# EAGLE design auxDaqUnit (EAGLE 9.6.1)
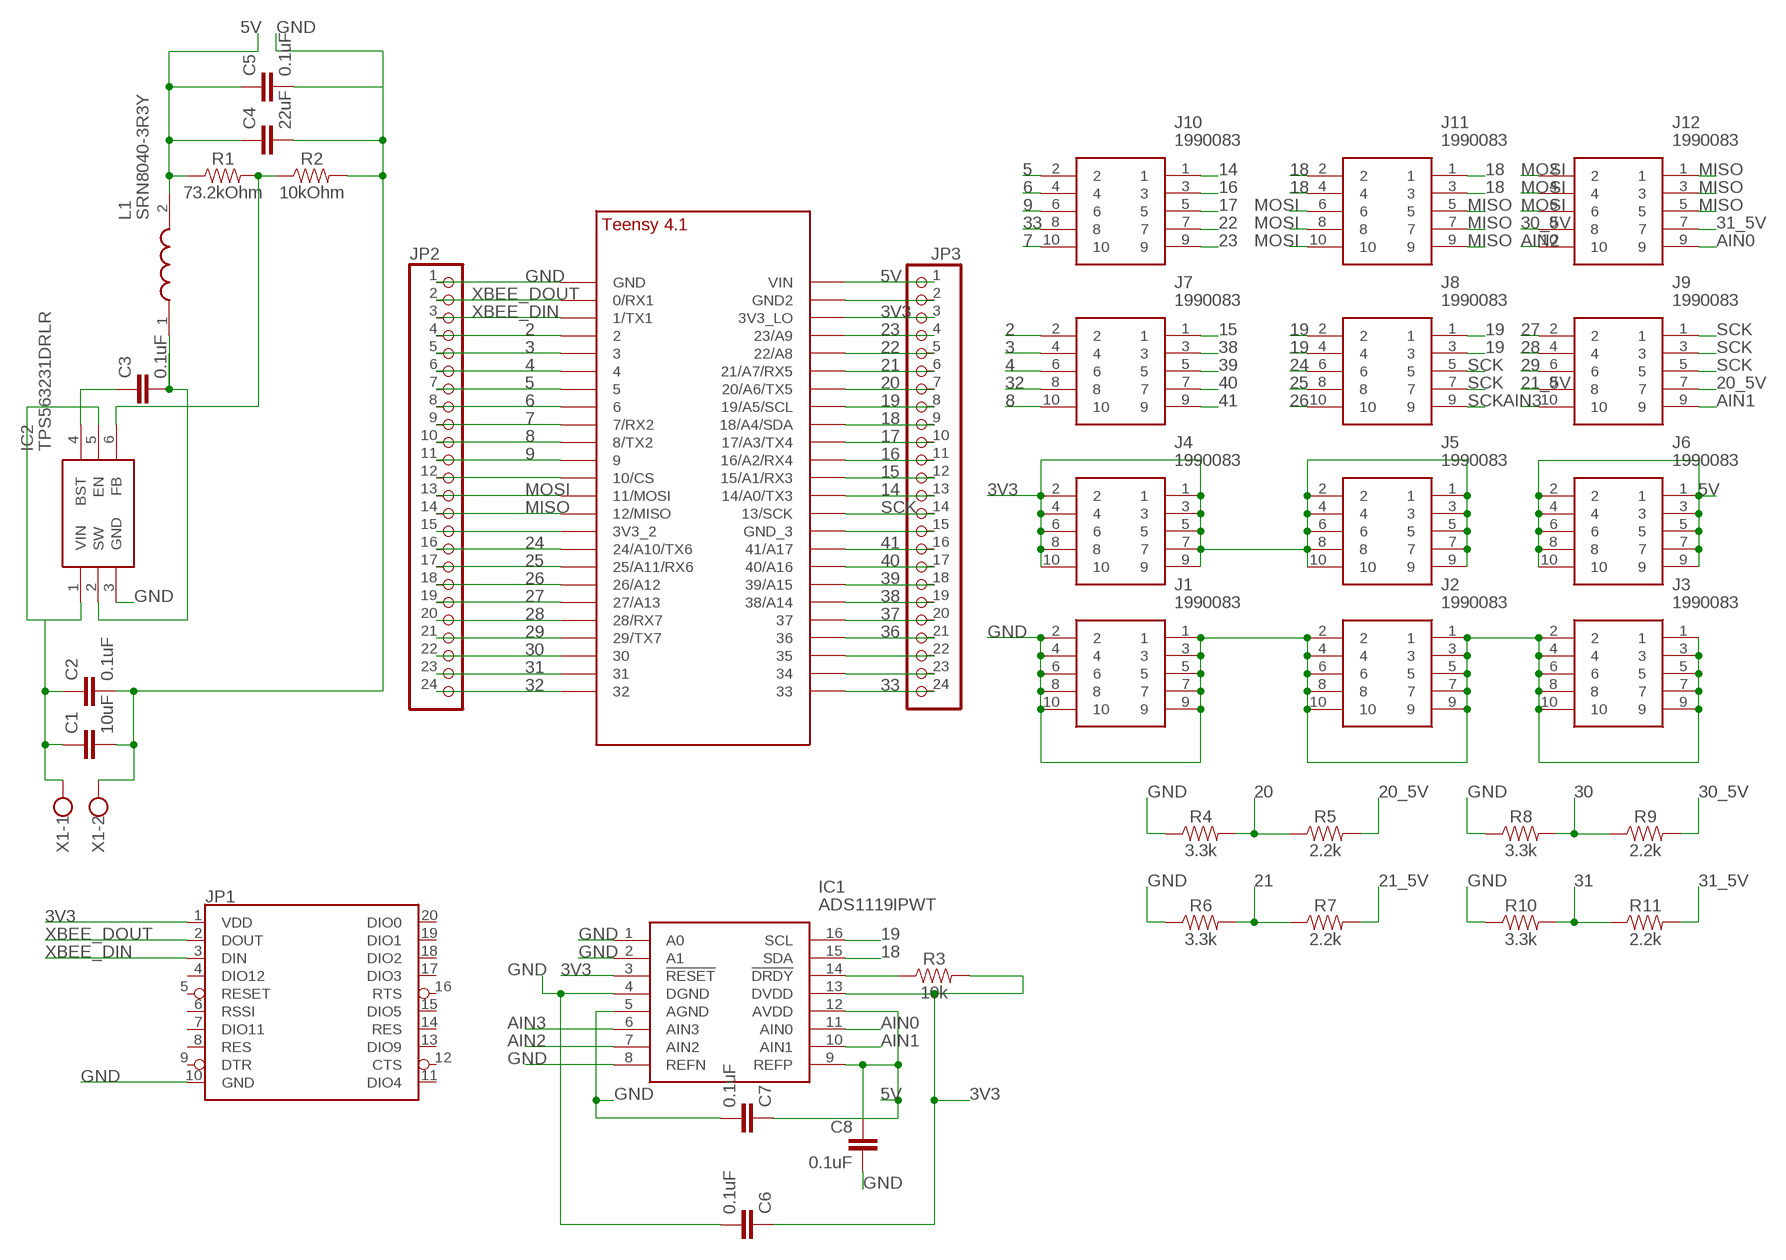
[diagram p0: schematic, sheet 1]

## Parts
C1  10uF  10UF-0603-6.3V-20%  [0603]
C2  0.1uF  0.1UF-0603-25V-(+80/-20%)  [0603]
C3  0.1uF  0.1UF-0603-25V-(+80/-20%)  [0603]
C4  22uF  22UF-0805-6.3V-20%  [0805]
C5  0.1uF  0.1UF-0603-25V-(+80/-20%)  [0603]
C6  0.1uF  0.1UF-0603-25V-(+80/-20%)  [0603]
C7  0.1uF  0.1UF-0603-25V-(+80/-20%)  [0603]
C8  0.1uF  0.1UF-0603-25V-(+80/-20%)  [0603]
IC1  ADS1119IPWT  [SOP65P640X120-16N]
IC2  TPS563231DRLR  [SOTFL50P160X60-6N]
J1  1990083  [1990083]
J2  1990083  [1990083]
J3  1990083  [1990083]
J4  1990083  [1990083]
J5  1990083  [1990083]
J6  1990083  [1990083]
J7  1990083  [1990083]
J8  1990083  [1990083]
J9  1990083  [1990083]
J10  1990083  [1990083]
J11  1990083  [1990083]
J12  1990083  [1990083]
JP1  XBEE  [XBEE]
JP2  PINHD-1X24  [1X24]
JP3  PINHD-1X24  [1X24]
L1  SRN8040-3R3Y  [SRN8040-3R3Y]
R1  73.2kOhm  RESISTOR0603  [0603]
R2  10kOhm  RESISTOR0603  [0603]
R3  10k  10KOHM-0603-1/10W-1%  [0603]
R4  3.3k  3.3KOHM-0603-1/10W-1%  [0603]
R5  2.2k  2.2KOHM-0603-1/10W-1%  [0603]
R6  3.3k  3.3KOHM-0603-1/10W-1%  [0603]
R7  2.2k  2.2KOHM-0603-1/10W-1%  [0603]
R8  3.3k  3.3KOHM-0603-1/10W-1%  [0603]
R9  2.2k  2.2KOHM-0603-1/10W-1%  [0603]
R10  3.3k  3.3KOHM-0603-1/10W-1%  [0603]
R11  2.2k  2.2KOHM-0603-1/10W-1%  [0603]
U$1  TEENSY_4.1_SIMPLE  [TEENSY_4.1_SIMPLE]
X1  W237-102  [W237-102]

## Nets
2: J7.2 JP2.4 U$1.2
3: J7.4 JP2.5 U$1.3/CANTX
3V3: C6.1 IC1.3(!RESET) IC1.13(DVDD) J4.1 J4.2 J4.3 J4.4 J4.5 J4.6 J4.7 J4.8 J4.9 J4.10 J5.1 J5.2 J5.3 J5.4 J5.5 J5.6 J5.7 J5.8 J5.9 J5.10 JP1.1(VDD) JP3.3 R3.2 U$1.3V3_LO
4: J7.6 JP2.6 U$1.4/CANRX
5: J10.2 JP2.7 U$1.5
5V: C4.1 C5.1 C7.1 C8.1 IC1.9(REFP) IC1.12(AVDD) J6.1 J6.2 J6.3 J6.4 J6.5 J6.6 J6.7 J6.8 J6.9 J6.10 JP3.1 L1.2 R1.1 U$1.VIN
6: J10.4 JP2.8 U$1.6
7: J10.10 JP2.9 U$1.7(7/RX2)
8: J7.10 JP2.10 U$1.8(8/TX2)
9: J10.6 JP2.11 U$1.9/CS
14: J10.1 JP3.13 U$1.14/A0(14/A0/TX3)
15: J7.1 JP3.12 U$1.15/A1(15/A1/RX3)
16: J10.3 JP3.11 U$1.16/A2(16/A2/RX4)
17: J10.5 JP3.10 U$1.17/A3(17/A3/TX4)
18: IC1.15(SDA) J11.1 J11.2 J11.3 J11.4 JP3.9 U$1.18/A4/SDA
19: IC1.16(SCL) J8.1 J8.2 J8.3 J8.4 JP3.8 U$1.19/A5/SCL
20: JP3.7 R4.2 R5.1 U$1.20/A6(20/A6/TX5)
20_5V: J9.7 R5.2
21: JP3.6 R6.2 R7.1 U$1.21/A7(21/A7/RX5)
21_5V: J9.8 R7.2
22: J10.7 JP3.5 U$1.22/A8
23: J10.9 JP3.4 U$1.23/A9
24: J8.6 JP2.16 U$1.24/A10(24/A10/TX6)
25: J8.8 JP2.17 U$1.25/A11(25/A11/RX6)
26: J8.10 JP2.18 U$1.26/A12
27: J9.2 JP2.19 U$1.27/A13
28: J9.4 JP2.20 U$1.28(28/RX7)
29: J9.6 JP2.21 U$1.29(29/TX7)
30: JP2.22 R8.2 R9.1 U$1.30
30_5V: J12.8 R9.2
31: JP2.23 R10.2 R11.1 U$1.31
31_5V: J12.7 R11.2
32: J7.8 JP2.24 U$1.32
33: J10.8 JP3.24 U$1.33
36: JP3.21 U$1.36
37: JP3.20 U$1.37
38: J7.3 JP3.19 U$1.38/A14
39: J7.5 JP3.18 U$1.39/A15
40: J7.7 JP3.17 U$1.40/A16
41: J7.9 JP3.16 U$1.41/A17
AIN0: IC1.11(AIN0) J12.9
AIN1: IC1.10(AIN1) J9.9
AIN2: IC1.7(AIN2) J12.10
AIN3: IC1.6(AIN3) J9.10
GND: C1.2 C2.2 C4.2 C5.2 C6.2 C7.2 C8.2 IC1.1(A0) IC1.2(A1) IC1.4(DGND) IC1.5(AGND) IC1.8(REFN) IC2.3(GND) J1.1 J1.2 J1.3 J1.4 J1.5 J1.6 J1.7 J1.8 J1.9 J1.10 J2.1 J2.2 J2.3 J2.4 J2.5 J2.6 J2.7 J2.8 J2.9 J2.10 J3.1 J3.2 J3.3 J3.4 J3.5 J3.6 J3.7 J3.8 J3.9 J3.10 JP1.10(GND) JP2.1 R2.2 R4.1 R6.1 R8.1 R10.1 U$1.GND X1.2
GNDBLOCK: JP3.2 U$1.GND2
MISO: J11.5 J11.7 J11.9 J12.1 J12.3 J12.5 JP2.14 U$1.12/MISO
MOSI: J11.6 J11.8 J11.10 J12.2 J12.4 J12.6 JP2.13 U$1.11/MOSI
N$1: C3.1 IC2.4(BST)
N$2: C1.1 C2.1 IC2.1(VIN) IC2.5(EN) X1.1
N$3: C3.2 IC2.2(SW) L1.1
N$4: IC1.14(!DRDY) R3.1
N$5: IC2.6(FB) R1.2 R2.1
N$6: JP2.12 U$1.10/CS
N$7: JP2.15 U$1.3V3_2
N$13: JP3.15 U$1.GND3(GND_3)
N$14: JP3.22 U$1.35
N$15: JP3.23 U$1.34
SCK: J8.5 J8.7 J8.9 J9.1 J9.3 J9.5 JP3.14 U$1.13/SCK
XBEE_DIN: JP1.3(DIN) JP2.3 U$1.1/TX(1/TX1)
XBEE_DOUT: JP1.2(DOUT) JP2.2 U$1.0/RX(0/RX1)
Unconnected: JP1.4(DIO12) JP1.5(RESET) JP1.6(RSSI) JP1.7(DIO11) JP1.8(RES) JP1.9(DTR) JP1.11(DIO4) JP1.12(CTS) JP1.13(DIO9) JP1.14(RES) JP1.15(DIO5) JP1.16(RTS) JP1.17(DIO3) JP1.18(DIO2) JP1.19(DIO1) JP1.20(DIO0)

## Library data of the parts
C1 = SparkFun-Capacitors:10UF: 10.0µF ceramic capacitors A capacitor is a passive two-terminal electrical component used to store electrical energy temporarily in an electric field.; PROD_ID: CAP-11015
C2 C3 C5-C8 = SparkFun-Capacitors:0.1UF: 0.1µF ceramic capacitors A capacitor is a passive two-terminal electrical component used to store electrical energy temporarily in an electric field.; PROD_ID: CAP-00810
C4 = SparkFun-Capacitors:22UF: 22µF ceramic capacitors A capacitor is a passive two-terminal electrical component used to store electrical energy temporarily in an electric field.; PROD_ID: CAP-08402
IC1 = ADS1119IPWT:ADS1119IPWT: Analog to Digital Converters - ADC 16-Bit, 1kSPS, 4-Ch General-Purpose Delta-Sigma ADC w/ I2C Interface and External Vref Inputs Source: Datasheet <http://www.ti.com/lit/ds/symlink/ads1119.pdf>; ARROW_PART_NUMBER: ADS1119IPWT; ARROW_PRICE-STOCK: https://www.arrow.com/en/products/ads1119ipwt/texas-instruments; DESCRIPTION: Analog to Digital Converters - ADC 16-Bit, 1kSPS, 4-Ch General-Purpose Delta-Sigma ADC w/ I2C Interface and External Vref Inputs; HEIGHT: 1.2mm; MANUFACTURER_NAME: Texas Instruments; MANUFACTURER_PART_NUMBER: ADS1119IPWT; MOUSER_PART_NUMBER: 595-ADS1119IPWT; MOUSER_PRICE-STOCK: https://www.mouser.co.uk/ProductDetail/Texas-Instruments/ADS1119IPWT?qs=lc2O%252BfHJPVYEGRBqvq3fYA%3D%3D
IC2 = TPS563231DRLR:TPS563231DRLR: 4.5-V to 17-V input, 3-A synchronous step-down voltage regulator Source: Datasheet <http://www.ti.com/lit/gpn/TPS563231>; ARROW_PART_NUMBER: TPS563231DRLR; ARROW_PRICE-STOCK: https://www.arrow.com/en/products/tps563231drlr/texas-instruments; DESCRIPTION: 4.5-V to 17-V input, 3-A synchronous step-down voltage regulator; HEIGHT: 0.6mm; MANUFACTURER_NAME: Texas Instruments; MANUFACTURER_PART_NUMBER: TPS563231DRLR; MOUSER_PART_NUMBER: 595-TPS563231DRLR; MOUSER_PRICE-STOCK: https://www.mouser.co.uk/ProductDetail/Texas-Instruments/TPS563231DRLR?qs=9r4v7xj2LnkEuOskP1euBg%3D%3D
J1-J12 = 1990083:1990083: Phoenix Contact PTSA 0.5/10-2.5-Z Non-Fused Terminal Block, 10 Way/Pole, Solder Terminals, 24 20 AWG Source: Datasheet <https://www.phoenixcontact.com/online/portal/in/?uri=pxc-oc-itemdetail:pid=1990083&library=inen&pcck=P-11-01-05&tab=1&selectedCategory=ALL>; ARROW_PART_NUMBER: 1990083; ARROW_PRICE-STOCK: https://www.arrow.com/en/products/1990083/phoenix-contact; DESCRIPTION: Phoenix Contact PTSA 0.5/10-2.5-Z Non-Fused Terminal Block, 10 Way/Pole, Solder Terminals, 24 20 AWG; HEIGHT: 13.1mm; MANUFACTURER_NAME: Phoenix Contact; MANUFACTURER_PART_NUMBER: 1990083; MOUSER_PART_NUMBER: 651-1990083; MOUSER_PRICE-STOCK: https://www.mouser.co.uk/ProductDetail/Phoenix-Contact/1990083?qs=eiqBpq341KUxP7V1ZFOCBQ%3D%3D
JP1 = SparkFun-RF:XBEE: Digi XBee and XBee Pro XBees are tiny blue chips that can communicate wirelessly with each other. They can do simple things, like replacing a couple of wires in serial communication, which is nice when you want to make a remote for your paintball vehicle. SparkFun Products SparkFun XBee Buying Guide <https://www.sparkfun.com/pages/xbee_guide> SparkFun XBee Explorer USB <https://www.sparkfun.com/products/11812> (WRL-11812) Breakout Board for XBee Module <https://www.sparkfun.com/products/8276> (WRL-8276) SparkFun XBee Explorer Regulated <https://www.sparkfun.com/products/11373> (WRL-11373) SparkFun XBee Explorer Dongle <https://www.sparkfun.com/products/11697> (WRL-11697) SparkFun XBee Shield <https://www.sparkfun.com/products/12847> (WRL-12847) SparkFun XBee Explorer Serial <https://www.sparkfun.com/products/13225> (WRL-13225)
JP2 JP3 = pinhead:PINHD-1X24: PIN HEADER
L1 = SRN8040-3R3Y:SRN8040-3R3Y: Power Inductor semi-shielded SMD 3.3uH Bourns SRN8040 Series Shielded Wire-wound SMD Inductor with a Ferrite Core, 3.3 uH +/-30% 5.6A Idc Source: Datasheet <http://www.bourns.com/data/global/pdfs/SRN8040.pdf>; ARROW_PART_NUMBER: SRN8040-3R3Y; ARROW_PRICE-STOCK: https://www.arrow.com/en/products/srn8040-3r3y/bourns; DESCRIPTION: Power Inductor semi-shielded SMD 3.3uH Bourns SRN8040 Series Shielded Wire-wound SMD Inductor with a Ferrite Core, 3.3 uH +/-30% 5.6A Idc; HEIGHT: mm; MANUFACTURER_NAME: Bourns; MANUFACTURER_PART_NUMBER: SRN8040-3R3Y; MOUSER_PART_NUMBER: 652-SRN8040-3R3Y; MOUSER_PRICE-STOCK: https://www.mouser.co.uk/ProductDetail/Bourns/SRN8040-3R3Y?qs=opBjA1TV9010KZW9Pid7mg%3D%3D
R1 R2 = SparkFun-Resistors:RESISTOR: Generic Resistor Package
R3 = SparkFun-Resistors:10KOHM: 10kΩ resistor A resistor is a passive two-terminal electrical component that implements electrical resistance as a circuit element. Resistors act to reduce current flow, and, at the same time, act to lower voltage levels within circuits. - Wikipedia; PROD_ID: RES-00824
R4 R6 R8 R10 = SparkFun-Resistors:3.3KOHM: 3.3kΩ resistor A resistor is a passive two-terminal electrical component that implements electrical resistance as a circuit element. Resistors act to reduce current flow, and, at the same time, act to lower voltage levels within circuits. - Wikipedia; PROD_ID: RES-07851
R5 R7 R9 R11 = SparkFun-Resistors:2.2KOHM: 2.2kΩ resistor A resistor is a passive two-terminal electrical component that implements electrical resistance as a circuit element. Resistors act to reduce current flow, and, at the same time, act to lower voltage levels within circuits. - Wikipedia; PROD_ID: RES-08272
U$1 = TEENSY:TEENSY_4.1_SIMPLE
X1 = con-wago-500:W237-102: WAGO SCREW CLAMP; MPN: 237-102; OC_FARNELL: unknown; OC_NEWARK: 70K9898

## Board
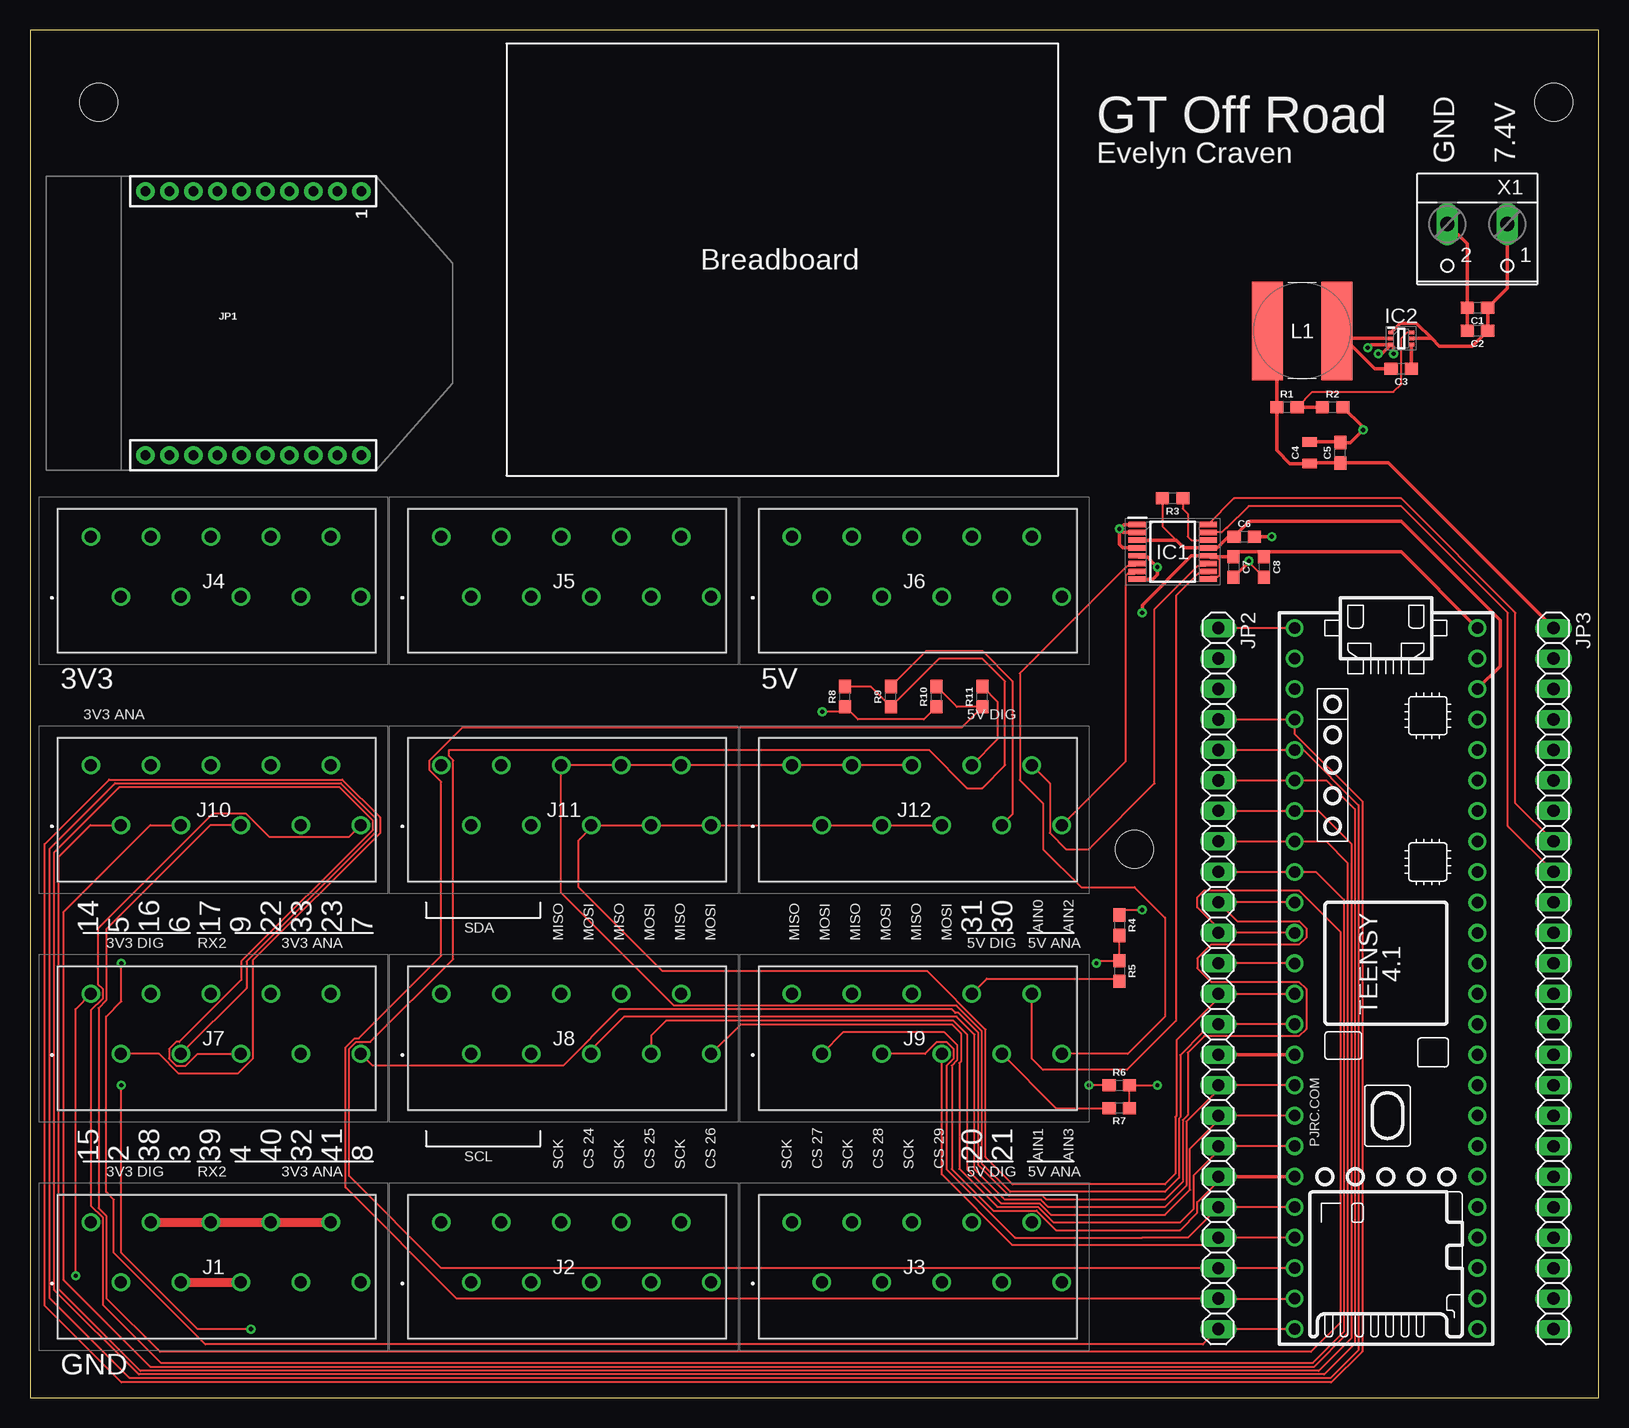
[diagram p1: board, top side]
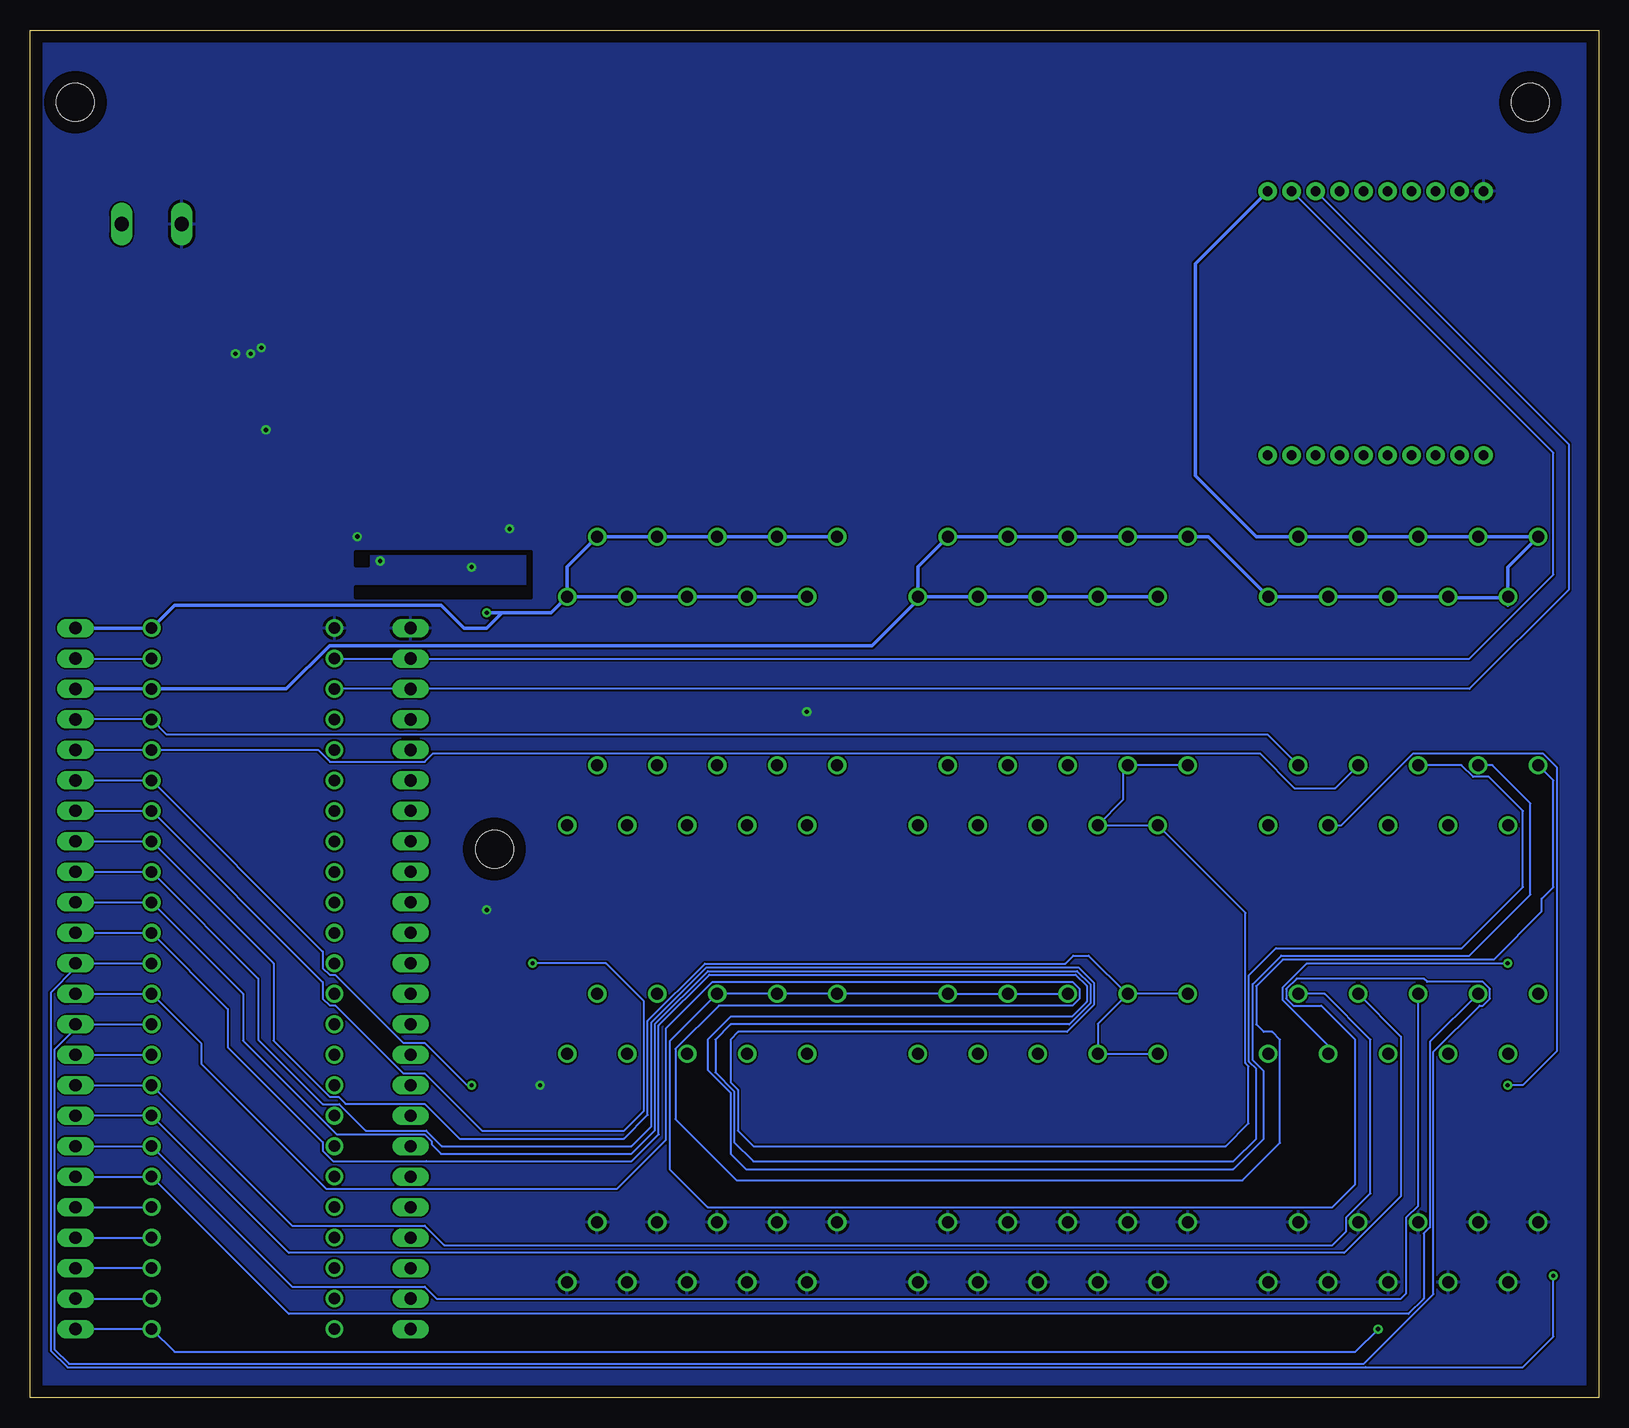
[diagram p2: board, bottom side, seen from below]

Size 130.79 x 113.97 mm. Coordinates in mm from the lower left corner, seen from the top.
Outline: 0,0 130.79,0 130.79,113.97 0,113.97 0,0
Copper layers (1*16): Top 0.035mm / dielectric 1.5mm / Bottom 0.035mm
Design rules "default": minimum track width 6mil, minimum drill 0.35mm, track to track 6mil, track to pad 6mil, pad to pad 6mil, via to via 6mil, smd to smd 6mil, copper to edge 40mil, drill to drill 6mil, minimum pad ring 10mil, minimum via ring 8mil, stop-mask expansion 4mil, vias tented up to drill 0mil, thermal gap 10mil
Holes 3.15 mm at 5.71,107.95 127,107.95 92.08,45.72
bRestrict: area 89,66.7 to 103.6,70.5

### Footprints (pad centres in the part's own frame; a part is rotated, then mirrored left to right if it is on the bottom)
0603 = smd 1.1 x 1: 1 -0.85,0; 2 0.85,0
0805 = smd 0.8 x 1.2: 1 -0.9,0; 2 0.9,0
SOP65P640X120-16N = smd 1.475 x 0.45: 1 -2.938,2.275; 2 -2.938,1.625; 3 -2.938,0.975; 4 -2.938,0.325; 5 -2.938,-0.325; 6 -2.938,-0.975; 7 -2.938,-1.625; 8 -2.938,-2.275; 9 2.938,-2.275; 10 2.938,-1.625; 11 2.938,-0.975; 12 2.938,-0.325; 13 2.938,0.325; 14 2.938,0.975; 15 2.938,1.625; 16 2.938,2.275
SOTFL50P160X60-6N = smd 0.475 x 0.3: 1 -0.838,0.5; 2 -0.838,0; 3 -0.838,-0.5; 4 0.838,-0.5; 5 0.838,0; 6 0.838,0.5
1990083 = drill 1 pad 1.5: 1 0,0; 2 2.5,-5; 3 5,0; 4 7.5,-5; 5 10,0; 6 12.5,-5; 7 15,0; 8 17.5,-5; 9 20,0; 10 22.5,-5
XBEE = drill 0.8 pad 1.524: 1 -11,20; 2 -11,18; 3 -11,16; 4 -11,14; 5 -11,12; 6 -11,10; 7 -11,8; 8 -11,6; 9 -11,4; 10 -11,2; 11 11,2; 12 11,4; 13 11,6; 14 11,8; 15 11,10; 16 11,12; 17 11,14; 18 11,16; 19 11,18; 20 11,20
1X24 = drill 1.016 long: 1 -29.21,0; 2 -26.67,0; 3 -24.13,0; 4 -21.59,0; 5 -19.05,0; 6 -16.51,0; 7 -13.97,0; 8 -11.43,0; 9 -8.89,0; 10 -6.35,0; 11 -3.81,0; 12 -1.27,0; 13 1.27,0; 14 3.81,0; 15 6.35,0; 16 8.89,0; 17 11.43,0; 18 13.97,0; 19 16.51,0; 20 19.05,0; 21 21.59,0; 22 24.13,0; 23 26.67,0; 24 29.21,0
SRN8040-3R3Y = smd 2.6 x 8.2: 1 -2.9,0; 2 2.9,0
TEENSY_4.1_SIMPLE = drill 0.965: 0/RX -25.4,-7.62; 1/TX -22.86,-7.62; 2 -20.32,-7.62; 3/CANTX -17.78,-7.62; 3V3_2 7.62,-7.62; 3V3_LO -22.86,7.62; 4/CANRX -15.24,-7.62; 5 -12.7,-7.62; 6 -10.16,-7.62; 7 -7.62,-7.62; 8 -5.08,-7.62; 9/CS -2.54,-7.62; 10/CS 0,-7.62; 11/MOSI 2.54,-7.62; 12/MISO 5.08,-7.62; 13/SCK 5.08,7.62; 14/A0 2.54,7.62; 15/A1 0,7.62; 16/A2 -2.54,7.62; 17/A3 -5.08,7.62; 18/A4/SDA -7.62,7.62; 19/A5/SCL -10.16,7.62; 20/A6 -12.7,7.62; 21/A7 -15.24,7.62; 22/A8 -17.78,7.62; 23/A9 -20.32,7.62; 24/A10 10.16,-7.62; 25/A11 12.7,-7.62; 26/A12 15.24,-7.62; 27/A13 17.78,-7.62; 28 20.32,-7.62; 29 22.86,-7.62; 30 25.4,-7.62; 31 27.94,-7.62; 32 30.48,-7.62; 33 30.48,7.62; 34 27.94,7.62; 35 25.4,7.62; 36 22.86,7.62; 37 20.32,7.62; 38/A14 17.78,7.62; 39/A15 15.24,7.62; 40/A16 12.7,7.62; 41/A17 10.16,7.62; GND -27.94,-7.62; GND2 -25.4,7.62; GND3 7.62,7.62; VIN -27.94,7.62
W237-102 = drill 1.194 long: 1 -2.5,-1.27; 2 2.5,-1.27

### Placement (x,y rotation side)
C1  120.65,90.81 180 top
C2  120.65,88.9 180 top
C3  114.3,85.72 180 top
C4  106.68,78.74 90 top
C5  109.22,78.74 90 top
C6  101.22,71.75 0 top
C7  100.33,69.22 270 top
C8  102.87,69.22 270 top
IC1  95.25,70.48 0 top
IC2  114.3,88.27 0 top
J1  5.08,14.61 0 top
J2  34.29,14.61 0 top
J3  63.5,14.61 0 top
J4  5.08,71.75 0 top
J5  34.29,71.75 0 top
J6  63.5,71.75 0 top
J7  5.08,33.66 0 top
J8  34.29,33.66 0 top
J9  63.5,33.66 0 top
J10  5.08,52.7 0 top
J11  34.29,52.7 0 top
J12  63.5,52.7 0 top
JP1  7.62,89.53 270 top
JP2  99.06,34.92 270 top
JP3  127,34.92 270 top
L1  106.05,88.9 180 top
R1  104.78,82.55 0 top
R2  108.58,82.55 0 top
R3  95.25,74.93 180 top
R4  90.81,39.37 270 top
R5  90.81,35.56 270 top
R6  90.81,26.04 0 top
R7  90.81,24.13 180 top
R8  67.94,58.42 90 top
R9  71.75,58.42 90 top
R10  75.56,58.42 90 top
R11  79.38,58.42 90 top
U$1  113.03,36.2 270 top
X1  120.65,96.52 180 top

### Tracks (layer width: path | path; a pad name or v marks a point on that pad's centre or on a via)
2
  Top 0.152: JP2.4 U$1.2 105.41,55.34 111.05,49.7 111.05,3.84 108.48,1.27 7.62,1.27 1.22,7.67 1.22,46.14 6.59,51.51 26.03,51.51 29.17,48.37 29.17,47.05 18.56,36.44 18.56,28.25 17.32,27 12.41,27 10.76,28.66 J7.2
3
  Top 0.152: JP2.5 U$1.3/CANTX 106.14,53.98 110.74,49.37 110.74,3.97 108.4,1.63 8.31,1.63 1.65,8.28 1.65,45.76 7.1,51.2 25.9,51.2 28.87,48.24 28.87,47.17 18.06,36.36 18.06,34.13 J7.4
3V3
  Top 0.152: R3.2 94.4,72.61 95.55,71.46
  Top 0.305: IC1.3 95.55,71.46 96.19,70.81 IC1.13 98.92,70.8 99.88,71.75 C6.1 101.64,73.03 114.3,73.03 122.56,64.77 122.56,60.96 U$1.3V3_LO
  Bottom 0.305: 7.62,66.67 7.62,69.22 J4.1 J4.3 J4.5 J4.7 J4.9 28.57,71.75 33.66,76.83 33.66,94.5 JP1.1 | 7.62,66.67 7.62,66.04 7.58,66.08 J4.2 | 7.62,66.67 12.5,66.67 J4.4 J4.6 J4.8 J4.10 | J4.10 27.86,66.75 27.94,66.67 27.66,66.67 J4.10 | J4.10 32.58,71.75 J5.1 J5.3 J5.5 J5.7 J5.9 56.79,69.25 J5.10 56.52,66.75 | 56.52,66.75 J5.8 J5.6 J5.4 J5.2 | JP3.3 U$1.3V3_LO 109.42,59.05 105.82,62.66 60.61,62.66 56.52,66.75
4
  Top 0.152: JP2.6 U$1.4/CANRX 108.05,51.44 110.44,49.04 110.44,4.48 107.89,1.93 9.07,1.93 2.03,8.97 2.03,45.45 7.48,50.9 25.78,50.9 28.56,48.11 28.56,47.3 17.62,36.35 17.62,34.8 12.45,29.64 12.17,29.64 11.6,29.06 11.6,28.25 12.17,27.67 12.99,27.67 13.97,28.66 J7.6
5
  Top 0.152: JP2.7 U$1.5 107.41,48.9 110.13,46.17 110.13,4.94 107.43,2.23 9.2,2.23 2.41,9.02 2.41,45.08 5.04,47.7 J10.2
5V  (via drill 0.35)
  Top 0.152: IC1.12 98.38,69.96 99.02,69.96 99.15,69.83 99.15,68.54 99.02,68.41 98.38,68.41 IC1.9 | C8.1 102.87,70.48
  Top 0.305: v92.71,65.41 92.71,66.04 96.83,70.16 IC1.12 98.28,70.06 C7.1 100.75,70.48 102.87,70.48 114.3,70.48 U$1.VIN | L1.2 103.92,88.12 R1.1 103.92,78.95 105.04,77.84 C4.1 106.73,77.89 C5.1 113.25,77.89 JP3.1
  Bottom 0.305: J6.1 J6.3 J6.5 J6.7 J6.9 86,69.25 J6.10 | J6.10 J6.8 J6.6 J6.4 J6.2 | JP3.1 U$1.VIN 118.75,66.04 96.52,66.04 94.61,64.14 92.71,64.14 91.44,65.41 | J6.10 87.35,65.41 91.44,65.41 | 91.44,65.41 v92.71,65.41
6
  Top 0.152: JP2.8 U$1.6 108.05,46.35 109.83,44.57 109.83,5.37 107,2.54 10.08,2.54 2.83,9.79 2.83,40.49 10.04,47.7 J10.4
7
  Top 0.152: JP2.9 U$1.7 107.21,43.81 109.53,41.5 109.53,5.49 106.94,2.91 10.9,2.91 6.06,7.75 6.06,15.01 5.08,15.99 5.08,32.27 6.06,33.25 6.06,34.06 5.66,34.47 5.66,39.08 15.27,48.69 17.99,48.69 19.95,46.72 26.6,46.72 J10.10
8
  Top 0.152: U$1.8 JP2.10 100.64,39.7 105.81,39.7 106.38,39.13 106.38,38.34 105.78,37.74 98.45,37.74 97.31,36.6 97.31,35.78 98.45,34.65 105.78,34.65 106.38,34.05 106.38,30.71 105.78,30.12 97.89,30.12 96.52,28.76 96.52,23.55 96.09,23.12 96.09,17.98 94.61,16.51 84.71,16.51 84.41,16.81 81.62,16.81 79.05,19.38 79.05,30.42 77.41,32.05 77.14,32.05 76.83,32.36 49.1,32.36 44.42,27.67 28.56,27.67 J7.10
9
  Top 0.152: U$1.9/CS JP2.11 99.06,39.11 97.31,40.87 97.31,41.69 97.89,42.27 105.78,42.27 109.22,38.83 109.22,6.25 106.78,3.81 10.84,3.81 6.37,8.28 6.37,13.36 6.37,13.37 6.37,15.14 5.71,15.79 5.71,32.47 6.37,33.12 6.37,39.03 15.04,47.7 J10.6
14
  Bottom 0.152: JP3.13 U$1.14/A0 116.51,29.52 116.51,27.81 106.12,17.42 81.84,17.42 77.78,21.49 77.78,30.77 73.91,34.64 43.88,34.64 43.31,34.06 43.31,33.25 43.88,32.67 73.37,32.67 76.98,29.06 76.98,23.21 71.88,18.11 29.72,18.11 26.6,21.23 26.6,29.84 27.23,30.48 27.94,30.48 28.56,31.1 28.56,34.29 26.35,36.5 8.79,36.5 4.78,40.51 4.78,41.58 3.81,42.55 3.81,51.44 J10.1
15  (via drill 0.35)
  Top 0.152: v3.81,10.16 3.81,32.38 J7.1
  Bottom 0.152: U$1.15/A1 JP3.12 127,35.82 129.06,33.76 129.06,3.91 127.66,2.52 19.48,2.52 19.46,2.54 6.35,2.54 3.81,5.08 v3.81,10.16
16
  Bottom 0.152: JP3.11 U$1.16/A2 114.3,32.38 114.3,29.21 106.38,21.29 106.38,20.55 105.53,19.71 97.76,19.71 97.74,19.68 80.64,19.68 78.38,21.95 78.38,31.02 74.16,35.25 43.63,35.25 42.7,34.31 42.7,32.99 43.94,31.75 72.39,31.75 74.3,29.84 74.3,27.3 72.39,25.4 72.39,20.32 71.12,19.05 30.48,19.05 27.94,21.59 27.94,27.19 28.87,28.12 28.87,34.45 26.49,36.83 10.79,36.83 5.71,41.91 5.71,49.53 8.89,52.7 J10.3
17
  Bottom 0.152: JP3.10 U$1.17/A3 113.03,33.66 113.03,29.75 105.23,21.95 97.89,21.95 97.31,21.36 97.31,21.11 96.52,20.32 80.64,20.32 78.69,22.28 78.69,31.15 74.29,35.55 43.5,35.55 42.39,34.44 42.39,32.87 44.15,31.11 72.39,31.11 73.66,29.84 73.66,27.1 72.08,25.53 72.08,21.29 70.48,19.68 30.48,19.68 28.57,21.59 28.57,27.4 29.17,28 29.17,35.22 26.92,37.47 11.43,37.47 6.35,42.55 6.35,48.9 9.18,51.72 10.49,51.72 11.47,52.7 J10.5
18
  Top 0.152: JP3.9 123.19,47.62 123.19,65.41 114.3,74.3 101.6,74.3 99.79,72.48 99.72,72.48 99.35,72.11 IC1.15
  Bottom 0.152: JP3.9 U$1.18/A4/SDA 111.76,34.92 111.76,29.84 106.38,24.46 105.01,24.46 102.8,22.25 97.76,22.25 96.47,20.95 80.64,20.95 78.99,22.61 78.99,31.27 74.41,35.86 43.38,35.86 42.09,34.57 42.09,32.74 44.35,30.48 71.75,30.48 72.39,29.84 72.39,26.26 71.78,25.65 71.78,22.25 70.48,20.95 31.11,20.95 29.21,22.86 29.21,27.6 29.48,27.87 29.48,40.39 36.77,47.69 | 36.77,47.69 J11.2 | 36.77,47.69 41.77,47.69 J11.4 39.65,49.85 39.65,52.35 J11.3 J11.1
19
  Top 0.152: JP3.8 123.83,49.53 123.83,65.41 114.3,74.93 100.36,74.93 IC1.16
  Bottom 0.152: JP3.8 U$1.19/A5/SCL 110.49,36.2 110.49,29.75 105.81,25.07 105.08,25.07 104.5,24.49 97.89,24.49 94.99,21.59 81.28,21.59 79.3,23.57 79.3,31.4 74.54,36.16 44.48,36.16 43.81,36.83 42.55,36.83 39.33,33.62 | J8.1 J8.3 39.33,33.62 | 39.33,33.62 41.79,31.16 J8.4 J8.2
20  (via drill 0.35)
  Top 0.152: R4.2 R5.1 89.11,36.41 v88.9,36.2
  Bottom 0.152: JP3.7 U$1.20/A6 106.38,34.62 106.38,33.26 105.81,32.69 105.34,32.69 99.67,27.03 97.89,27.03 93.09,22.23 81.28,22.23 79.6,23.9 79.6,33.02 82.78,36.2 v88.9,36.2
20_5V
  Top 0.152: J9.7 79.77,34.92 90.59,34.92 R5.2
21  (via drill 0.35)
  Top 0.152: v93.98,26.04 R6.2 R7.1
  Bottom 0.152: v93.98,26.04 94.36,26.04 97.89,29.57 99.67,29.57 105.34,35.23 105.81,35.23 106.38,35.8 106.38,37.16 U$1.21/A7 JP3.6
21_5V
  Top 0.152: R7.2 85.53,24.13 J9.8
22
  Bottom 0.152: JP3.5 U$1.22/A8 106.78,53.98 105.78,52.98 97.89,52.98 97.18,53.69 28.29,53.69 25.4,50.8 21.98,50.8 J10.7
23
  Bottom 0.152: J10.9 27.62,55.24 119.38,55.24 U$1.23/A9 JP3.4
24
  Top 0.152: U$1.24/A10 JP2.16 99.06,25.66 96.39,22.99 96.39,17.65 94.61,15.88 84.91,15.88 84.29,16.5 81.29,16.5 78.74,19.05 78.74,30.25 77.24,31.75 49.53,31.75 46.99,29.21 46.99,28.57 46.87,28.57 J8.6
25
  Top 0.152: U$1.25/A11 JP2.17 99.06,23.12 96.7,20.76 96.7,17.32 94.61,15.24 85.12,15.24 84.16,16.2 80.96,16.2 78.11,19.05 78.11,30.28 76.96,31.42 53.03,31.42 51.79,30.18 51.79,29.57 51.79,29.21 J8.8
26
  Top 0.152: U$1.26/A12 JP2.18 99.06,20.58 97,18.52 97,15.72 95.89,14.61 85.32,14.61 84.03,15.89 80.64,15.89 77.47,19.07 77.47,27.87 77.59,28 77.59,30.36 76.83,31.11 59.25,31.11 J8.10
27
  Top 0.152: J9.2 67.83,30.48 76.2,30.48 77.29,29.39 77.29,28.12 76.84,27.67 76.84,19.05 80.3,15.59 83.91,15.59 85.53,13.97 95.89,13.97 97.31,15.39 97.31,16.29 99.06,18.04 JP2.19
  Top 0.305: JP2.19 U$1.27/A13
28
  Top 0.152: U$1.28 JP2.20 96.52,13.34 92.71,13.34 | 92.71,13.34 | J9.4 74.61,28.66 75.59,29.64 76.41,29.64 76.98,29.06 76.98,28.25 76.41,27.67 76.41,19.05 82.12,13.34 92.71,13.34
29
  Top 0.152: U$1.29 JP2.21 98.42,12.7 87,12.7 86.88,12.7 81.92,12.7 76,18.61 J9.6
30
  Top 0.152: U$1.30 JP2.22 34.29,10.79 26.6,18.49 26.6,29.06 27.17,29.64 28.37,29.64 35.27,36.54 35.27,53.11 34.92,53.46 34.92,53.98 74.93,53.98 78.11,50.8 79.38,50.8 81.28,52.7 81.28,59.69 79.38,61.59 75.78,61.59 R9.1 70.06,59.27 R8.2
30_5V
  Top 0.152: R9.2 74.72,62.23 79.38,62.23 81.92,59.69 81.92,48.62 J12.8
31
  Top 0.152: U$1.31 JP2.23 35.56,8.26 26.29,17.52 26.29,29.19 27.05,29.94 27.4,29.94 34.29,36.83 34.29,51.31 33.31,52.3 33.31,53.11 36.08,55.88 77.69,55.88 R11.1 77.27,57.57 R10.2
31_5V
  Top 0.152: R11.2 80.64,58 80.64,54.85 J12.7
32  (via drill 0.35)
  Top 0.152: U$1.32 JP2.24 97.79,4.45 14.61,4.45 6.99,12.06 6.99,16.51 6.35,17.14 6.35,31.75 7.62,33.02 v7.62,36.2
  Bottom 0.152: J7.8 22.58,29.33 26.37,33.12 26.37,34.19 24.36,36.2 v7.62,36.2
33  (via drill 0.35)
  Top 0.152: v18.41,5.71 13.97,5.71 7.62,12.06 v7.62,26.04
  Bottom 0.152: JP3.24 U$1.33 118.75,3.81 20.32,3.81 v18.41,5.71 | v7.62,26.04 6.35,26.04 3.5,28.88 3.5,52.52 4.67,53.69 15.49,53.69 21.47,47.7 J10.8
36
  Bottom 0.152: JP3.21 U$1.36
37
  Bottom 0.152: JP3.20 U$1.37
38
  Bottom 0.152: JP3.19 U$1.38/A14 109.22,6.99 15.88,6.99 14.61,8.26 14.61,13.69 14.1,14.2 14.1,29.64 J7.3
39
  Bottom 0.152: JP3.18 U$1.39/A15 108.94,9.25 97.89,9.25 96.9,8.26 16.51,8.26 16.06,8.7 16.06,15.01 15.08,15.99 J7.5
40
  Bottom 0.152: J7.7 16.51,30.09 16.51,16.79 21.23,12.06 109.22,12.06 U$1.40/A16 JP3.17
41
  Bottom 0.152: JP3.16 U$1.41/A17 108.94,14.33 97.89,14.33 96.26,12.7 22.23,12.7 21.06,13.86 21.06,15.01 19.05,17.02 19.05,29.84 22.86,33.66 J7.9
AIN0
  Top 0.152: J12.9 85.02,51.19 85.02,47.06 86.36,45.72 88.27,45.72 93.74,51.2 93.74,65.7 97.36,69.31 97.99,69.31 IC1.11
AIN1
  Top 0.152: IC1.10 97.55,68.86 95.53,66.83 95.53,37.47 95.53,37.43 95.53,31.39 91.44,27.3 84.45,27.3 83.5,28.26 J9.9
AIN2
  Top 0.152: IC1.7 92.12,68.66 91.48,68.66 91.35,68.53 91.35,53.05 J12.10
AIN3
  Top 0.152: IC1.6 92.12,69.31 91.48,69.31 82.52,60.35 82.52,51.47 84.45,49.53 84.45,45.72 87.63,42.55 92.08,42.55 94.61,40.01 94.61,31.75 91.52,28.66 J9.10
GND  (via drill 0.35)
  Top 0.152: U$1.GND JP2.1 | R6.1 v88.27,26.04 | R4.1 91.22,40.64 v92.71,40.64 | R10.1 74.51,56.52 69,56.52 R8.1 67.53,57.15 v66.04,57.15 | C8.2 101.6,69.64
  Top 0.305: IC1.5 92.43,70.04 93.18,70.04 93.35,69.86 93.35,69.84 v93.98,69.22 93.98,68.58 93.61,68.21 IC1.8 | v101.6,69.72 101.6,69.64 C7.2 100.17,68.21 | C6.2 v103.5,71.75 | IC1.4 91.11,70.81 90.81,71.12 v90.81,72.39 | IC1.1 91.17,72.76 v90.81,72.39 | IC1.2 91.08,72.11 v90.81,72.39 | C4.2 109.17,79.64 C5.2 110.07,79.59 v111.12,80.64 111.12,80.86 R2.2 | C2.2 C1.2 119.8,96.14 X1.2 | IC2.3 113.45,87.76 111.76,87.76 v111.51,87.5 | IC2.3 112.69,87 v112.39,87 | IC2.3 113.67,87.56 v113.67,87
  Top 0.762: J1.3 J1.5 J1.7 J1.9 | J1.4 J1.6
  pour Bottom: 130.81,114.3 130.81,0 0,0 0,114.3
GNDBLOCK
  Bottom 0.152: JP3.2 U$1.GND2
MISO
  Top 0.152: U$1.12/MISO JP2.14 98.37,30.43 97.76,30.43 95.89,28.55 95.89,23.34 95.78,23.24 95.78,18.31 94.61,17.14 81.71,17.14 79.35,19.51 79.35,30.55 77.23,32.66 77.13,32.66 76.83,32.66 53.7,32.66 44.29,42.07 J11.5 J11.7 J11.9 J12.1 J12.3 J12.5
MOSI
  Top 0.152: J11.6 46.99,47.7 | 46.99,47.7 J11.8 J11.10 J12.2 J12.4 J12.6 | U$1.11/MOSI JP2.13 99.06,33.28 95.58,29.8 95.58,23.47 95.48,23.37 95.48,18.64 94.61,17.78 81.92,17.78 79.65,20.04 79.65,30.68 74.77,35.56 52.7,35.56 45.72,42.55 45.72,46.44 46.99,47.7
N$1
  Top 0.305: IC2.4 115.14,85.74 C3.1
N$2
  Top 0.305: X1.1 123.15,92.45 C1.1 C2.1 120.23,87.63 117.47,87.63 116.84,88.27 | IC2.5 116.84,88.27 | 116.84,88.27 115.57,89.53 114.23,89.53 IC2.1
N$3
  Top 0.305: IC2.2 109.58,88.27 L1.1 112.12,85.72 C3.2
N$4
  Top 0.152: R3.1 96.1,74.08 96.52,73.66 96.52,71.75 96.81,71.46 IC1.14
N$5
  Top 0.152: R1.2 106.89,83.82 113.67,83.82 114.3,84.45 114.3,88.27 114.8,88.77 IC2.6
  Top 0.305: R1.2 R2.1
N$6
  Top 0.152: U$1.10/CS JP2.12
N$7
  Top 0.305: JP2.15 U$1.3V3_2
N$13
  Bottom 0.152: JP3.15 U$1.GND3
N$14
  Bottom 0.152: U$1.35 JP3.22
N$15
  Bottom 0.152: JP3.23 U$1.34
SCK
  Bottom 0.152: U$1.13/SCK JP3.14 127,30.74 128.75,28.98 128.75,4.04 127.54,2.82 19.61,2.82 13.79,8.64 13.79,28.83 9.95,32.67 9.67,32.67 9.1,33.25 9.1,34.06 9.67,34.64 14.32,34.64 14.61,34.92 25.2,34.92 26.06,34.06 26.06,33.25 25.49,32.67 23.15,32.67 20.32,29.84 20.32,17.78 22.23,15.88 74.3,15.88 77.47,19.05 77.47,29.68 J9.5 J9.3 J9.1 J8.9 J8.7 J8.5
XBEE_DIN
  Bottom 0.152: JP1.3 2.54,79.45 2.54,67.31 10.79,59.05 JP2.3 U$1.1/TX
XBEE_DOUT
  Bottom 0.152: U$1.0/RX JP2.2 10.79,61.59 3.81,68.58 3.81,78.72 JP1.2

### Text on the board
tPlace: GT Off Road | Evelyn Craven | GND | 7.4V | Breadboard | 3V3 | 5V | 3V3 ANA | 5V DIG | 14 | 5 | 16 | 6 | 17 | 9 | 22 | 33 | 23 | 7 | SDA | 31 | 30 | AIN0 | AIN2 | MISO | MOSI | MISO | MOSI | MISO | MOSI | MISO | MOSI | MISO | MOSI | MISO | MOSI | 3V3 DIG | RX2 | 3V3 ANA | 5V DIG | 5V ANA | 15 | 2 | 38 | 3 | 39 | 4 | 40 | 32 | 41 | 8 | SCL | 20 | 21 | AIN1 | AIN3 | SCK | CS 24 | SCK | CS 25 | SCK | CS 26 | SCK | CS 27 | SCK | CS 28 | SCK | CS 29 | 3V3 DIG | RX2 | 3V3 ANA | 5V DIG | 5V ANA | GND